# EasyEDA Pro project ProPrj_智能车主控V5.0-20251108_2026-08-26.epro, schematic Schematic1_2
Assembly Variant: Basic; Board Name: Board1; Create Date: 2026-01-27; Page Name: P1; Project Name: 智能车主控V3.1-20251108; Schematic Name: Schematic1; Update Date: 2026-01-27; Company: 嘉立创EDA; Page Size: A4; Version: V1.0
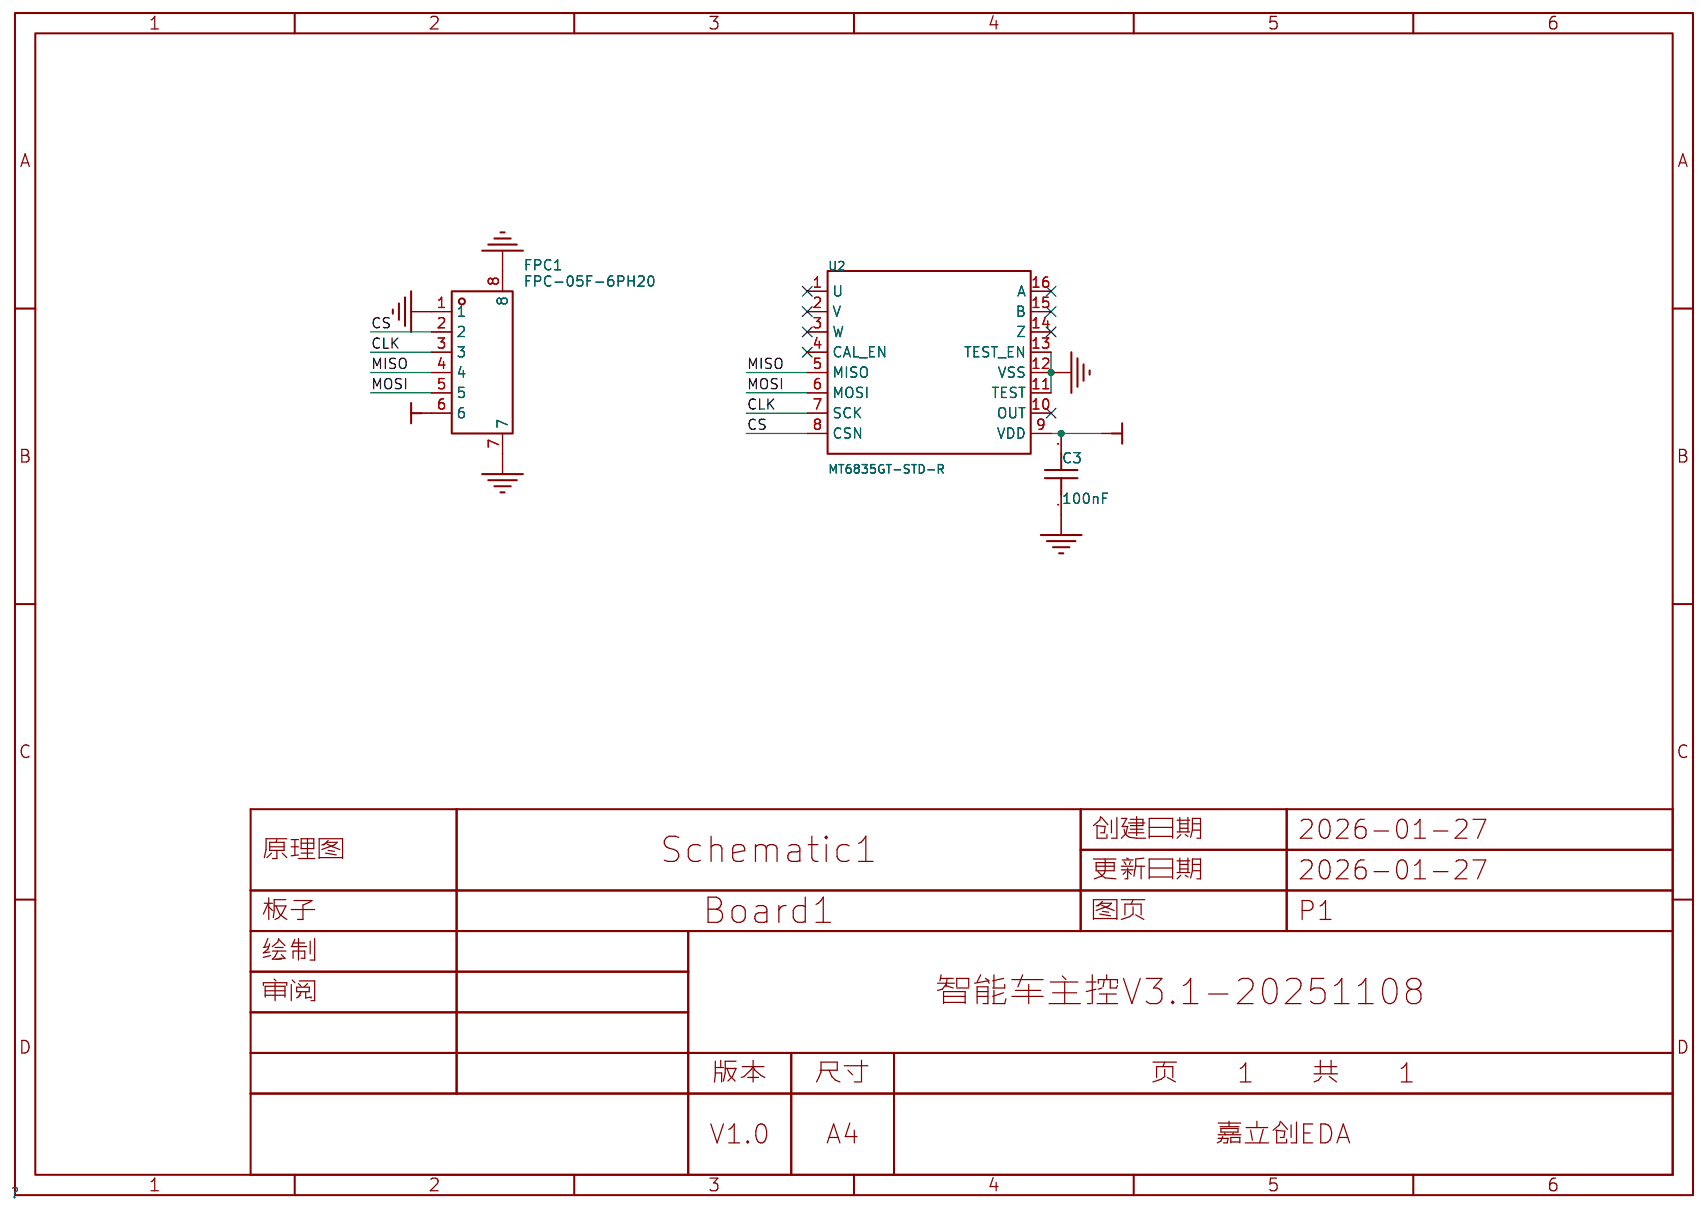
[diagram p1: schematic sheet]

## Parts
C3  100nF  [C0402]
FPC1  FPC-05F-6PH20  [FPC-SMD_6P-P0.50_XUNPU_FPC-05F-6PH20]
U2  MT6835GT-STD-R  [TSSOP-16_L5.0-W4.4-P0.65-LS6.4-BL]

## Library data of the parts
C3 = CL05B104KB54PNC: 容值:100nF;精度:±10%;额定电压:50V;温度系数:X7R;; LCSC Part Name: 100nF ±10% 50V; Supplier Part: C307331; Manufacturer: SAMSUNG(三星); Supplier Footprint: 0402; JLCPCB Part Class: Basic Part; Datasheet: https://item.szlcsc.com/datasheet/CL05B104KB54PNC/291005.html; Supplier: LCSC; Tolerance: ±10%; Voltage Rating: 50V; Temperature Coefficient: X7R
FPC1 = FPC-05F-6PH20: 锁定特性:翻盖式;触点类型:卧贴;触点数量:6P;间距:0.5mm;安装方式:下接;工作温度:-25℃~+85℃;; LCSC Part Name: 翻盖式 卧贴 P数:6P 间距:0.5mm; Supplier Part: C2856796; Manufacturer: XUNPU(讯普); Supplier Footprint: SMD,P=0.5mm,卧贴; JLCPCB Part Class: Extended Part; Datasheet: https://item.szlcsc.com/datasheet/FPC-05F-6PH20/3056894.html; Supplier: LCSC; Locking Feature: 翻盖式; Contact Type: 卧贴; Number of Contacts: 6P; Pitch: 0.5mm; Mounting Type: 下接; FFC, FCB Thickness: 0.3mm; Height Above Board: 2mm; Contact Material: 磷青铜; Contact Plating: 锡; Operating Temperature: -25℃~+85℃; Rated Voltage (Max): 50V; Current Rating (Max): 500mA
U2 = MT6835GT-STD-R: 类型:磁性旋转位置传感器;接口类型:SPI;旋转角度范围:0°~360°;; LCSC Part Name: 21位高分辨率、高精度磁性角度编码器IC; Supplier Part: C2932578; Manufacturer: NOVOSENSE(纳芯微); Supplier Footprint: TSSOP-16; JLCPCB Part Class: Extended Part; Datasheet: https://item.szlcsc.com/datasheet/MT6835GT-STD-R/3278069.html; Supplier: LCSC; Type: 磁性旋转位置传感器; Interface: SPI; Voltage - Supply: 3V~5.5V; Rotation Angle: 0°~360°; Current - Supply: 22mA; Module: 否; Length: 5mm; Width: 4.4mm; Height: 1.2mm; Operating Temperature: -40℃~+125℃; Features: 故障诊断；零位编程；角度非线性补偿；自校准

## Nets
GND: C3.1 FPC1.1 FPC1.7 FPC1.8 U2.11(TEST) U2.12(VSS) U2.13(TEST_EN)
VCC: C3.2 FPC1.6 U2.9(VDD)
CLK: FPC1.3 U2.7(SCK)
CS: FPC1.2 U2.8(CSN)
MISO: FPC1.4 U2.5(MISO)
MOSI: FPC1.5 U2.6(MOSI)

Not connected (* = marked no-connect by the designer): U2 1(U)* 2(V)* 3(W)* 4(CAL_EN)* 10(OUT)* 14(Z)* 15(B)* 16(A)*
